# EAGLE design BLCTRL20 (EAGLE 6.1)
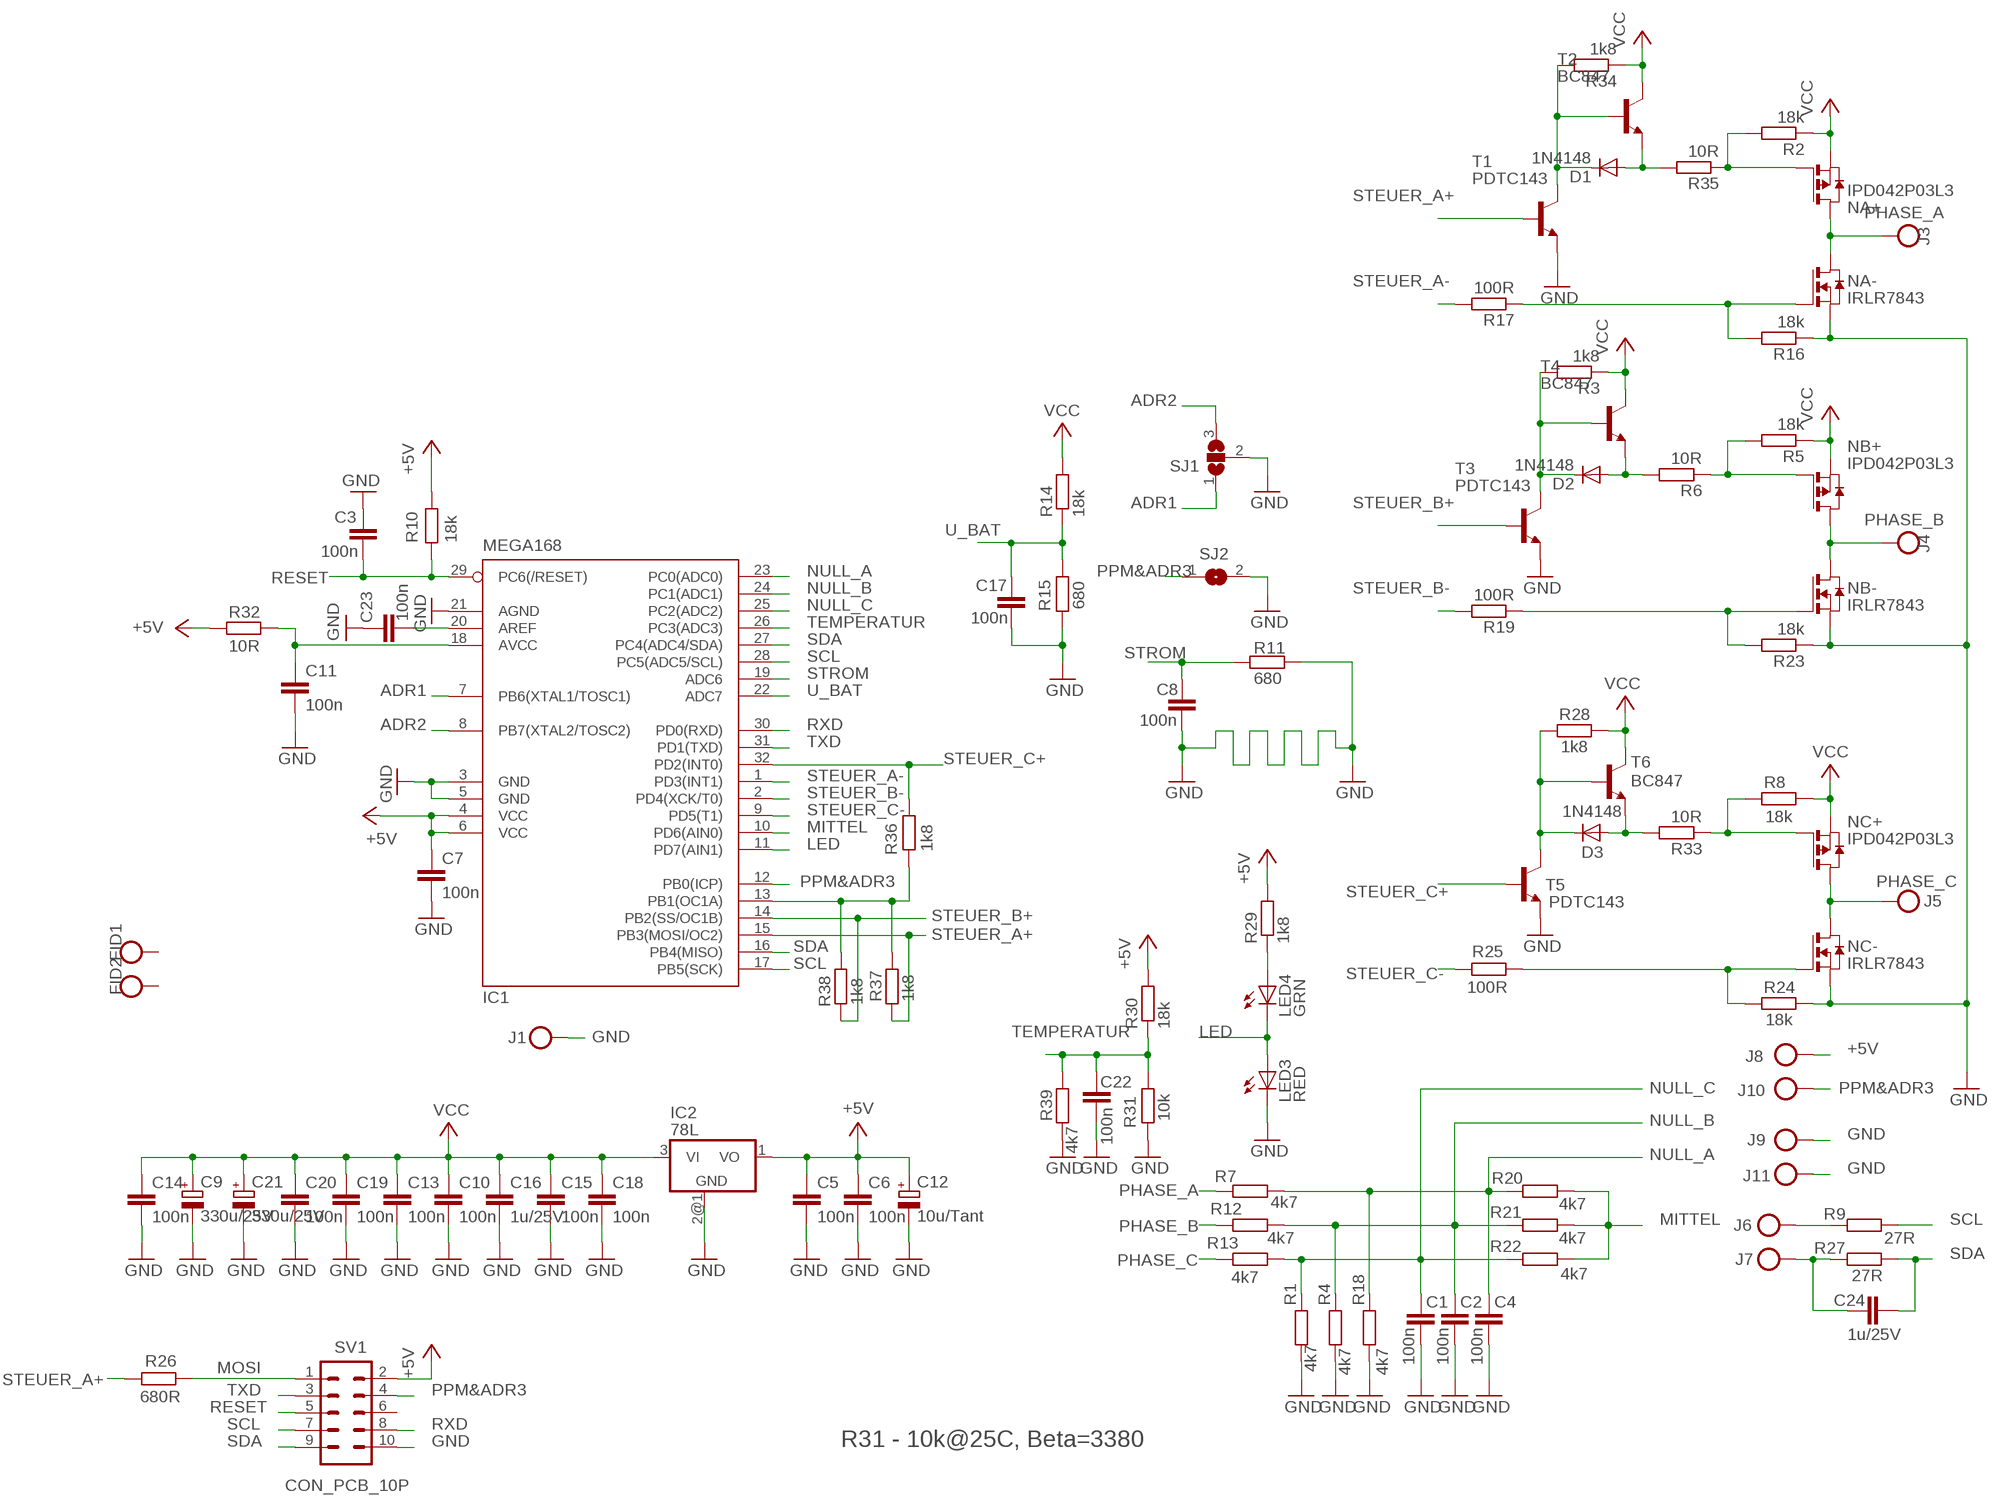
[diagram p0: schematic, sheet 1]

## Parts
C1  100n  C-EUC0603  [C0603]
C2  100n  C-EUC0603  [C0603]
C3  100n  C-EUC0603  [C0603]
C4  100n  C-EUC0603  [C0603]
C5  100n  C-EUC0603  [C0603]
C6  100n  C-EUC0603  [C0603]
C7  100n  C-EUC0603  [C0603]
C8  100n  C-EUC0603  [C0603]
C9  330u/25V  CPOL-EUE2.5-5  [E2,5-5]
C10  100n  C-EUC0603  [C0603]
C11  100n  C-EUC0603  [C0603]
C12  10u/Tant  CPOL-EUB  [PANASONIC_B]
C13  100n  C-EUC0603  [C0603]
C14  100n  C-EUC0603  [C0603]
C15  100n  C-EUC0603  [C0603]
C16  1u/25V  C-EUC0603  [C0603]
C17  100n  C-EUC0603  [C0603]
C18  100n  C-EUC0603  [C0603]
C19  100n  C-EUC0603  [C0603]
C20  100n  C-EUC0603  [C0603]
C21  330u/25V  CPOL-EUE2.5-5  [E2,5-5]
C22  100n  C-EUC0603  [C0603]
C23  100n  C-EUC0603  [C0603]
C24  1u/25V  C-EUC0603  [C0603]
D1  1N4148  DIODE-SOD323-W  [SOD323-W]
D2  1N4148  DIODE-SOD323-W  [SOD323-W]
D3  1N4148  DIODE-SOD323-W  [SOD323-W]
FID1  FIDUCIAL  [FIDUCIAL_MARK]
FID2  FIDUCIAL  [FIDUCIAL_MARK]
IC1  MEGA168  [TQFP32-08]
IC2  78L  [SOT89]
J1  SMDPAD40X20  [PAD40X20]
J3  SMDPAD40X20  [PAD40X20]
J4  SMDPAD40X20  [PAD40X20]
J5  SMDPAD40X20  [PAD40X20]
J6  SE11  [SE11]
J7  SE11  [SE11]
J8  SMDPAD25X25  [PAD24X15]
J9  SMDPAD25X25  [PAD24X15]
J10  SMDPAD25X25  [PAD24X15]
J11  SMDPAD24X12  [PAD24X12]
LED3  RED  LEDCHIPLED_0603  [CHIPLED_0603]
LED4  GRN  LEDCHIPLED_0603  [CHIPLED_0603]
NA+  IPD042P03L3  [TO252]
NA-  IRLR7843  [TO252]
NB+  IPD042P03L3  [TO252]
NB-  IRLR7843  [TO252]
NC+  IPD042P03L3  [TO252]
NC-  IRLR7843  [TO252]
R1  4k7  R-EU_R0603  [R0603]
R2  18k  R-EU_R0805  [R0805]
R3  1k8  R-EU_R0603  [R0603]
R4  4k7  R-EU_R0603  [R0603]
R5  18k  R-EU_R0805  [R0805]
R6  10R  R-EU_R0603  [R0603]
R7  4k7  R-EU_R0603  [R0603]
R8  18k  R-EU_R0805  [R0805]
R9  27R  R-EU_R0603  [R0603]
R10  18k  R-EU_R0603  [R0603]
R11  680  R-EU_R0603  [R0603]
R12  4k7  R-EU_R0603  [R0603]
R13  4k7  R-EU_R0603  [R0603]
R14  18k  R-EU_R0603  [R0603]
R15  680  R-EU_R0603  [R0603]
R16  18k  R-EU_R0805  [R0805]
R17  100R  R-EU_R0603  [R0603]
R18  4k7  R-EU_R0603  [R0603]
R19  100R  R-EU_R0603  [R0603]
R20  4k7  R-EU_R0603  [R0603]
R21  4k7  R-EU_R0603  [R0603]
R22  4k7  R-EU_R0603  [R0603]
R23  18k  R-EU_R0805  [R0805]
R24  18k  R-EU_R0805  [R0805]
R25  100R  R-EU_R0603  [R0603]
R26  680R  R-EU_R0603  [R0603]
R27  27R  R-EU_R0603  [R0603]
R28  1k8  R-EU_R0603  [R0603]
R29  1k8  R-EU_R0603  [R0603]
R30  18k  R-EU_R0603  [R0603]
R31  10k  R-EU_R0603  [R0603]
R32  10R  R-EU_R0603  [R0603]
R33  10R  R-EU_R0603  [R0603]
R34  1k8  R-EU_R0603  [R0603]
R35  10R  R-EU_R0603  [R0603]
R36  1k8  R-EU_R0603  [R0603]
R37  1k8  R-EU_R0603  [R0603]
R38  1k8  R-EU_R0603  [R0603]
R39  4k7  R-EU_R0603  [R0603]
SJ1  SJ2W  [SJ_2]
SJ2  SJ  [SJ]
SV1  CON_PCB_10P  [BOARD_CON_SMD]
T1  PDTC143  [SC75_INFINEON]
T2  BC847  [SC75_INFINEON]
T3  PDTC143  [SC75_INFINEON]
T4  BC847  [SC75_INFINEON]
T5  PDTC143  [SC75_INFINEON]
T6  BC847  [SC75_INFINEON]

## Nets
+5V: C5.1 C6.1 C7.1 C12.+ IC1.4(VCC) IC1.6(VCC) IC2.1(VO) J8.P$1(MP) R10.2 R29.2 R30.2 R32.2 SV1.2
ADR1: IC1.7(PB6(XTAL1/TOSC1)) SJ1.1
ADR2: IC1.8(PB7(XTAL2/TOSC2)) SJ1.3
GND: C1.2 C2.2 C3.1 C4.2 C5.2 C6.2 C7.2 C8.2 C9.- C10.2 C11.2 C12.- C13.2 C14.2 C15.2 C16.2 C17.2 C18.2 C19.2 C20.2 C21.- C22.2 C23.1 IC1.3(GND) IC1.5(GND) IC1.21(AGND) IC2.2@1(GND) J1.P$1(MP) J9.P$1(MP) J11.P$1(MP) LED3.C NA-.3(S) NB-.3(S) NC-.3(S) R1.1 R4.1 R11.1 R15.1 R16.1 R18.1 R23.1 R24.1 R31.1 R39.1 SJ1.2 SJ2.2 SV1.10 T1.2(E) T3.2(E) T5.2(E)
LED: IC1.11(PD7(AIN1)) LED3.A LED4.C
MITTEL: IC1.10(PD6(AIN0)) R20.1 R21.1 R22.1
MOSI: R26.1 SV1.1
N$1: LED4.A R29.1
N$4: NA-.1(G) R16.2 R17.1
N$6: NA+.1(G) R2.2 R35.1
N$8: D1.A R35.2 T2.2(E)
N$9: D1.C R34.2 T1.3(C) T2.1(B)
N$10: C24.2 J7.MP R27.2
N$11: J6.MP R9.2
N$17: NC-.1(G) R24.2 R25.1
N$18: NB-.1(G) R19.1 R23.2
N$20: NC+.1(G) R8.2 R33.1
N$22: NB+.1(G) R5.2 R6.1
N$23: D2.A R6.2 T4.2(E)
N$24: D3.A R33.2 T6.2(E)
N$27: D2.C R3.2 T3.3(C) T4.1(B)
N$28: D3.C R28.2 T5.3(C) T6.1(B)
N$51: IC1.13(PB1(OC1A)) R36.1 R37.2 R38.2
N$72: C23.2 IC1.20(AREF)
N$73: C11.1 IC1.18(AVCC) R32.1
NULL_A: C4.1 IC1.23(PC0(ADC0)) R7.1 R18.2 R20.2
NULL_B: C2.1 IC1.24(PC1(ADC1)) R4.2 R12.1 R21.2
NULL_C: C1.1 IC1.25(PC2(ADC2)) R1.2 R13.1 R22.2
PHASE_A: J3.P$1(MP) NA+.2(D) NA-.2(D) R7.2
PHASE_B: J4.P$1(MP) NB+.2(D) NB-.2(D) R12.2
PHASE_C: J5.P$1(MP) NC+.2(D) NC-.2(D) R13.2
PPM&ADR3: IC1.12(PB0(ICP)) J10.P$1(MP) SJ2.1 SV1.4
RESET: C3.2 IC1.29(PC6(/RESET)) R10.1 SV1.5
RXD: IC1.30(PD0(RXD)) SV1.8
SCL: IC1.17(PB5(SCK)) IC1.28(PC5(ADC5/SCL)) R9.1 SV1.7
SDA: C24.1 IC1.16(PB4(MISO)) IC1.27(PC4(ADC4/SDA)) R27.1 SV1.9
STEUER_A+: IC1.15(PB3(MOSI/OC2)) R26.2 R37.1 T1.1(B)
STEUER_A-: IC1.1(PD3(INT1)) R17.2
STEUER_B+: IC1.14(PB2(SS/OC1B)) R38.1 T3.1(B)
STEUER_B-: IC1.2(PD4(XCK/T0)) R19.2
STEUER_C+: IC1.32(PD2(INT0)) R36.2 T5.1(B)
STEUER_C-: IC1.9(PD5(T1)) R25.2
STROM: C8.1 IC1.19(ADC6) R11.2
TEMPERATUR: C22.1 IC1.26(PC3(ADC3)) R30.1 R31.2 R39.2
TXD: IC1.31(PD1(TXD)) SV1.3
U_BAT: C17.1 IC1.22(ADC7) R14.1 R15.2
VCC: C9.+ C10.1 C13.1 C14.1 C15.1 C16.1 C18.1 C19.1 C20.1 C21.+ IC2.3(VI) NA+.3(S) NB+.3(S) NC+.3(S) R2.1 R3.1 R5.1 R8.1 R14.2 R28.1 R34.1 T2.3(C) T4.3(C) T6.3(C)
Unconnected: FID1.P$1(MP) FID2.P$1(MP) SV1.6

## Notes on the sheet
- R31 - 10k@25C, Beta=3380

## Library data of the parts
C1-C8 C10 C11 C13-C20 C22-C24 = blctrl20:C-EU: CAPACITOR, European symbol
C9 C12 C21 = blctrl20:CPOL-EU: POLARIZED CAPACITOR, European symbol
D1-D3 = blctrl20:DIODE-: DIODE
FID1 FID2 = blctrl20:FIDUCIAL
IC1 = blctrl20:MEGA168
IC2 = blctrl20:78L*: POSITOIV-VOLTAGE REGULATORS Output up to 100 mA Source: http://focus.ti.com/lit/ds/symlink/ua78l05.pdf
J1 J3-J5 J8-J11 = blctrl20:SMDPAD
J6 J7 = blctrl20:SE11: SOLDER PAD RTM, drill 1,1mm, distributor Buerklin, 07F810
LED3 LED4 = led:LED: LED OSRAM: - CHIPLED LG R971, LG N971, LY N971, LG Q971, LY Q971, LO R971, LY R971 LH N974, LH R974 LS Q976, LO Q976, LY Q976 LO Q996 - Hyper CHIPLED LW Q18S LB Q993, LB Q99A, LB R99A - SideLED LS A670, LO A670, LY A670, LG A670, LP A670 LB A673, LV A673, LT A673, LW A673 LH A674 LY A675 LS A676, LA A676, LO A676, LY A676, LW A676 LS A679, LY A679, LG A679 - Hyper Micro SIDELED® LS Y876, LA Y876, LO Y876, LY Y876 LT Y87S - SmartLED LW L88C, LW L88S LB L89C, LB L89S, LG L890 LS L89K, LO L89K, LY L89K LS L896, LA L896, LO L896, LY L896 - TOPLED LS T670, LO T670, LY T670, LG T670, LP T670 LSG T670, LSP T670, LSY T670, LOP T670, LYG T670 LG T671, LOG T671, LSG T671 LB T673, LV T673, LT T673, LW T673 LH T674 LS T676, LA T676, LO T676, LY T676, LB T676, LH T676, LSB T676, LW T676 LB T67C, LV T67C, LT T67C, LS T67K, LO T67K, LY T67K, LW E67C LS E67B, LA E67B, LO E67B, LY E67B, LB E67C, LV E67C, LT E67C LW T67C LS T679, LY T679, LG T679 LS T770, LO T770, LY T770, LG T770, LP T770 LB T773, LV T773, LT T773, LW T773 LH T774 LS E675, LA E675, LY E675, LS T675 LS T776, LA T776, LO T776, LY T776, LB T776 LHGB T686 LT T68C, LB T68C - Hyper Mini TOPLED® LB M676 - Mini TOPLED Santana® LG M470 LS M47K, LO M47K, LY M47K Source: http://www.osram.convergy.de LUXEON: - LUMILED® LXK2-PW12-R00, LXK2-PW12-S00, LXK2-PW14-U00, LXK2-PW14-V00 LXK2-PM12-R00, LXK2-PM12-S00, LXK2-PM14-U00 LXK2-PE12-Q00, LXK2-PE12-R00, LXK2-PE12-S00, LXK2-PE14-T00, LXK2-PE14-U00 LXK2-PB12-K00, LXK2-PB12-L00, LXK2-PB12-M00, LXK2-PB14-N00, LXK2-PB14-P00, LXK2-PB14-Q00 LXK2-PR12-L00, LXK2-PR12-M00, LXK2-PR14-Q00, LXK2-PR14-R00 LXK2-PD12-Q00, LXK2-PD12-R00, LXK2-PD12-S00 LXK2-PH12-R00, LXK2-PH12-S00 LXK2-PL12-P00, LXK2-PL12-Q00, LXK2-PL12-R00 Source: www.luxeon.com KINGBRIGHT: KA-3528ASYC Source: www.kingbright.com
NA+ NB+ NC+ = blctrl20:IPD042P03L3
NA- NB- NC- = blctrl20:IRLR7843
R1-R39 = blctrl20:R-EU_: RESISTOR, European symbol
SJ1 = jumper:SJ2W: SMD solder JUMPER
SJ2 = jumper:SJ: SMD solder JUMPER
SV1 = blctrl20:CON_PCB_10P
T1 T3 T5 = blctrl20:PDTC143
T2 T4 T6 = blctrl20:BC847: NPN TRANSISTOR

## Board
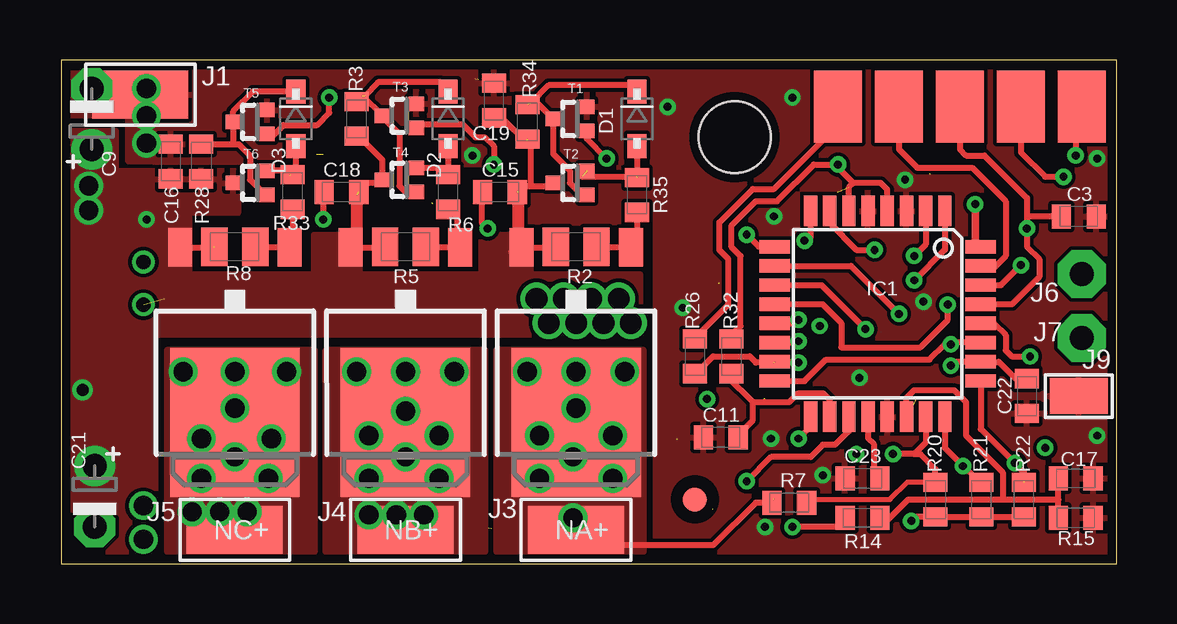
[diagram p1: board, top side]
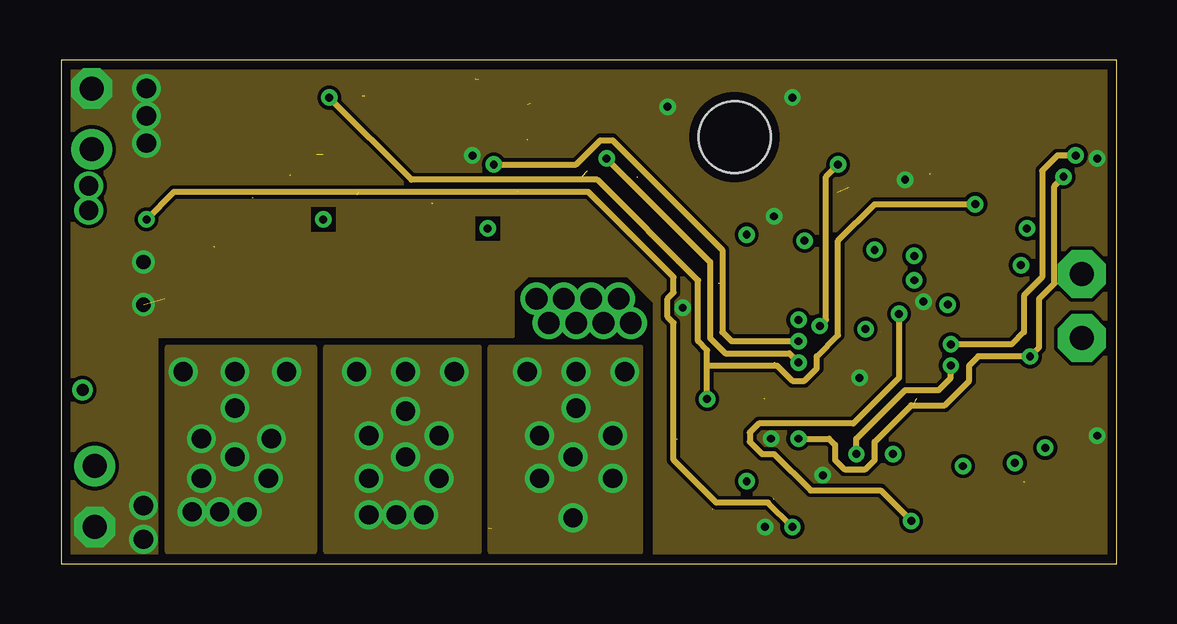
[diagram p2: board, inner layer Route2]
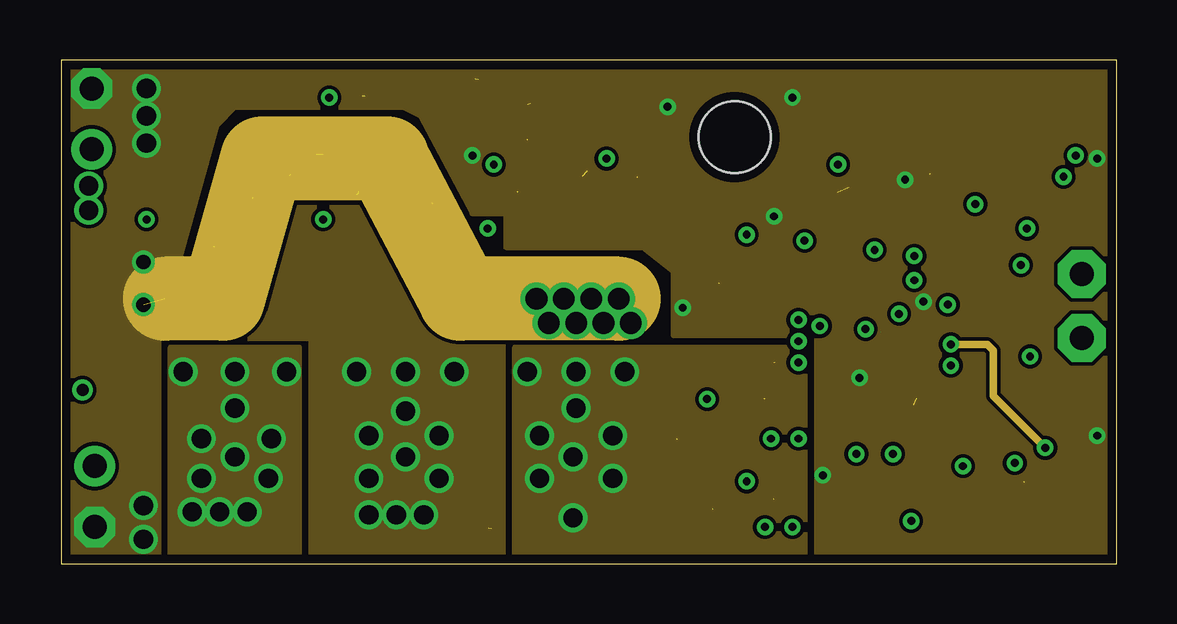
[diagram p3: board, inner layer Route15]
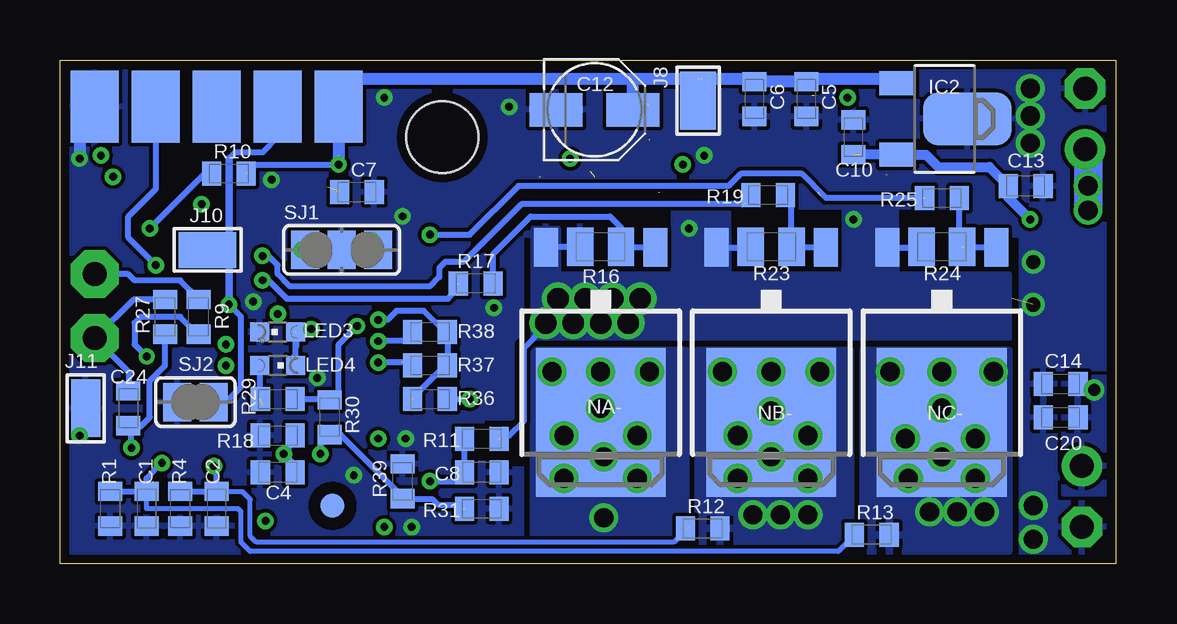
[diagram p4: board, bottom side, seen from below]

Size 44 x 21 mm. Coordinates in mm from the lower left corner, seen from the top.
Outline: 0,0 44,0 44,21 0,21 0,0
Copper layers (1*2*15*16): Top 0.035mm / dielectric 0.5mm / Route2 0.015mm / dielectric 0.5mm / Route15 0.015mm / dielectric 0.5mm / Bottom 0.035mm
Design rules: minimum track width 6mil, minimum drill 13mil, track to track 6mil, track to pad 6mil, pad to pad 6mil, via to via 6mil, smd to smd 6mil, copper to edge 15mil, drill to drill 6mil, minimum pad ring 7mil, minimum via ring 7mil, stop-mask expansion 4mil, vias tented up to drill 1mm, thermal gap 6mil
Holes 3 mm at 28.07,17.78
tRestrict: area 16,14 to 18.8,16.5; area 10.2,14 to 11.9,16.5
bRestrict: area 14.5,13.7 to 16,16; area 6.9,13.7 to 8.4,14.7; area 25.9,4.3 to 26.7,5.8; area 24.6,4.1 to 25.7,4.8; area 8.1,13.7 to 9,14.7; area 11.4,14.1 to 13.5,14.7; area 18.5,14.1 to 20.8,14.7

### Footprints (pad centres in the part's own frame; a part is rotated, then mirrored left to right if it is on the bottom)
C0603 = smd 0.8 x 1: 1 -0.723,0; 2 0.723,0
E2,5-5 = drill 1 pad 1.7: + -1.27,0 | drill 1 pad 1.7 octagon: - 1.27,0
PANASONIC_B = smd 2.2 x 1.4: + 1.6,0; - -1.6,0
SOD323-W = smd 1 x 0.8: A 1.143,0; C -1.143,0
FIDUCIAL_MARK = smd 1 x 1: P$1 0,0
TQFP32-08 = smd 1.27 x 0.559: 1 -4.293,2.8; 2 -4.293,2; 3 -4.293,1.2; 4 -4.293,0.4; 5 -4.293,-0.4; 6 -4.293,-1.2; 7 -4.293,-2; 8 -4.293,-2.8; 17 4.293,-2.8; 18 4.293,-2; 19 4.293,-1.2; 20 4.293,-0.4; 21 4.293,0.4; 22 4.293,1.2; 23 4.293,2; 24 4.293,2.8 | smd 0.559 x 1.27: 9 -2.8,-4.293; 10 -2,-4.293; 11 -1.2,-4.293; 12 -0.4,-4.293; 13 0.4,-4.293; 14 1.2,-4.293; 15 2,-4.293; 16 2.8,-4.293; 25 2.8,4.293; 26 2,4.293; 27 1.2,4.293; 28 0.4,4.293; 29 -0.4,4.293; 30 -1.2,4.293; 31 -2,4.293; 32 -2.8,4.293
SOT89 = smd 1 x 1.5: 1 -1.499,-1.981; 3 1.499,-1.981 | smd 2.2 x 3.7: 2@1 0,0.94
PAD40X20 = smd 4 x 2: P$1 0,0
SE11 = drill 1 pad 2 octagon: MP 0,0
PAD24X15 = smd 2.4 x 1.5: P$1 0,0
PAD24X12 = smd 2.4 x 1.2: P$1 0,0
CHIPLED_0603 = smd 0.8 x 0.8: A 0,-0.75; C 0,0.75
TO252 = smd 1 x 1.6: 1 -2.28,-4.8; 3 2.28,-4.8 | smd 5.4 x 6.2: 2 0,2.5
R0603 = smd 0.8 x 1: 1 -0.723,0; 2 0.723,0
R0805 = smd 1.1 x 1.6: 1 -0.85,0; 2 0.85,0
SJ_2 = smd 1.168 x 1.6: 1 -1.524,0; 2 0,0; 3 1.524,0
SJ = smd 1.168 x 1.6: 1 -0.762,0; 2 0.762,0
BOARD_CON_SMD = smd 2 x 3: 1 0,0; 3 2.54,0; 5 5.08,0; 7 7.62,0; 9 10.16,0 | smd 2 x 3 bottom: 2 0,0; 4 2.54,0; 6 5.08,0; 8 7.62,0; 10 10.16,0
SC75_INFINEON = smd 0.6 x 0.65: 1 -0.5,-0.702; 2 0.5,-0.702; 3 0,0.702

### Placement (x,y rotation side)
C1  40.39,2.29 270 bottom
C2  37.47,2.29 270 bottom
C3  42.42,14.48 180 top
C4  34.92,3.81 180 bottom
C5  12.89,19.37 270 bottom
C6  15.05,19.37 270 bottom
C7  31.62,15.49 0 bottom
C8  26.42,3.81 0 bottom
C9  1.27,18.54 90 top
C10  10.92,17.78 90 bottom
C11  27.5,5.27 180 top
C12  21.72,18.92 0 bottom
C13  3.75,15.75 0 bottom
C14  2.29,7.49 180 bottom
C15  18.29,15.49 180 top
C16  4.57,16.76 90 top
C17  42.29,1.91 0 top
C18  11.68,15.49 180 top
C19  18.03,19.3 90 top
C20  2.29,6.1 180 bottom
C21  1.4,2.79 270 top
C22  40.26,6.99 270 top
C23  33.4,3.56 0 top
C24  41.15,6.48 90 bottom
D1  24,18.54 270 top
D2  16.13,18.54 270 top
D3  9.78,18.54 270 top
FID1  26.42,2.67 0 top
FID2  32.64,2.41 0 bottom
IC1  34.04,10.41 270 top
IC2  7.11,18.54 270 bottom
J1  3.3,19.56 0 top
J3  21.46,1.4 0 top
J4  14.35,1.4 0 top
J5  7.24,1.4 0 top
J6  42.55,12.06 0 top
J7  42.55,9.4 0 top
J8  17.4,19.3 270 bottom
J9  42.42,6.99 0 top
J10  37.85,13.08 0 bottom
J11  42.93,6.48 270 bottom
LED3  34.92,9.65 90 bottom
LED4  34.92,8.26 270 bottom
NA+  21.46,8.38 180 top
NA-  21.46,8.38 180 bottom
NB+  14.35,8.38 180 top
NB-  14.35,8.38 180 bottom
NC+  7.24,8.38 180 top
NC-  7.24,8.38 180 bottom
R1  41.91,2.29 90 bottom
R2  21.46,13.21 0 top
R3  12.32,18.54 90 top
R4  38.99,2.29 90 bottom
R5  14.35,13.21 0 top
R6  16.13,15.49 90 top
R7  30.35,2.54 180 top
R8  7.24,13.21 0 top
R9  38.23,10.29 90 bottom
R10  36.96,16.26 0 bottom
R11  26.42,5.21 180 bottom
R12  17.21,1.46 0 bottom
R13  10.16,1.21 0 bottom
R14  33.4,1.91 180 top
R15  42.29,3.56 180 top
R16  21.46,13.21 0 bottom
R17  26.67,11.68 180 bottom
R18  34.92,5.33 0 bottom
R19  14.48,15.37 180 bottom
R20  36.45,2.67 90 top
R21  38.35,2.67 90 top
R22  40.13,2.67 90 top
R23  14.35,13.21 0 bottom
R24  7.24,13.21 0 bottom
R25  7.24,15.24 180 bottom
R26  26.42,8.64 270 top
R27  39.62,10.29 90 bottom
R28  5.84,16.76 90 top
R29  34.92,6.86 0 bottom
R30  32.77,6.1 90 bottom
R31  26.42,2.29 180 bottom
R32  27.94,8.64 90 top
R33  9.65,15.49 90 top
R34  19.43,18.41 90 top
R35  24,15.37 90 top
R36  28.57,6.86 0 bottom
R37  28.57,8.26 0 bottom
R38  28.57,9.65 0 bottom
R39  29.72,3.43 270 bottom
SJ1  32.26,13.08 0 bottom
SJ2  38.35,6.73 180 bottom
SV1  32.38,19.05 0 top
T1  21.21,18.54 90 top
T2  21.21,15.88 90 top
T3  14.1,18.67 90 top
T4  14.1,16 90 top
T5  7.87,18.41 90 top
T6  7.87,15.88 90 top

### Tracks (layer width: path | path; a pad name or v marks a point on that pad's centre or on a via)
+5V  (via drill 0.33 pad 0.41, 0.33 pad 0.69)  (3 unrouted)
  Top 0.254: R32.2 27.69,9.27 28.32,9.91 28.32,12.83 27.94,13.21 27.94,14.1 28.96,15.11 29.84,15.11 31.37,16.64 v32.38,16.64 32.38,16.51 33.02,15.88 | IC1.4 34.44,15.6 34.16,15.88 33.02,15.88 | IC1.6 32.84,15.69 33.02,15.88
  Route2 0.254: v31.62,9.91 31.88,10.16 31.88,16.13 v32.38,16.64
  Bottom 0.254: v31.62,9.91 32.38,9.14 32.38,7.11 32.51,7.11 R30.2 32.8,6.86 R29.2 | 32.35,16.55 v32.38,16.64 35.94,16.64 35.94,16.51 36.2,16.26 | 32.26,19.18 SV1.2
  Bottom 0.406: IC2.1 9.37,20.04 9.65,20.19 | 12.66,20.19 C5.1 | J8.P$1 17.4,20.19 | 32.26,20.19 32.26,19.18 | 20.12,20.12 20.19,20.19 | 15.18,20.22 C6.1
  Bottom 0.508: SV1.2 v32.38,16.64 | 9.65,20.19 12.66,20.19 | C5.1 C6.1 | 17.4,20.19 20.19,20.19 32.26,20.19 | C12.+ 20.12,20.12 | 17.25,20.22 15.18,20.22
ADR1  (via drill 0.33 pad 0.41)
  Top 0.254: v33.91,13.08 33.15,13.08 32.04,14.19 IC1.7
  Bottom 0.305: SJ1.1 33.66,12.83 v33.91,13.08
ADR2  (via drill 0.33 pad 0.41)
  Top 0.254: IC1.8 31.24,13.6 v30.99,13.46
  Bottom 0.305: v30.99,13.46 30.99,13.08 SJ1.3
GND  (via drill 0.33 pad 0.25, 0.33 pad 0.41, 0.6 pad 0.41, 0.8, 0.9)  (2 unrouted)
  Top 0.254: v3.56,17.53 4.57,17.53 | C18.2 10.92,15.49 v10.92,14.35 | C15.2 17.53,15.49 17.53,14.22 v17.78,13.97
  Route15 3.5: v23.24,11.05 16.64,11.05 13.59,16.89 8.38,16.89 6.73,11.05 4.32,11.05
  Bottom 0.254: SV1.10 42.55,18.92 43.18,18.03 | NC-.3 8.12,13.18 R24.1 | NB-.3 15.1,13.18 R23.1 | 23.88,9.78 24.68,8.98 24.68,5.93 25.27,5.33 25.53,5.33 25.65,5.21 | 20.45,10.16 20.57,10.29 | R16.1 23.72,13.21 NA-.3
  Bottom 0.508: 43.18,18.03 v43.18,16.89
  other vias: 19.81,11.05 20.32,10.03 20.95,11.05 21.46,10.03 22.1,11.05 22.61,10.03 23.75,10.03 3.56,19.81 3.56,18.67 3.43,2.41 3.43,1.02 33.27,7.75 29.72,14.48 3.43,12.57 3.43,10.79 35.94,10.92 29.59,5.21 29.34,1.52 31.75,3.68 35.18,16 30.48,19.43 25.27,19.05 17.14,17.02 25.91,10.67 43.18,5.33
  pour Top: 3.81,20.95 3.81,16.76 7.87,16.76 7.87,14.22 24.77,14.22 24.77,0 43.94,0 44.07,20.95
  pour Bottom (rank 2): 0,20.83 43.94,20.83 43.94,0 24.77,0 24.77,4.19 26.42,4.19 26.42,6.1 25.15,6.1 25.15,9.27 24.77,9.65 24.77,13.72 3.94,13.72 3.94,0 0,0 0,3.68 2.54,3.68 2.54,8.13 0,8.13
  pour Bottom (no thermals): 4.45,12.06 4.45,9.4 24.26,9.4 24.26,13.97 23.24,13.97 23.24,12.06 18.41,12.06 18.41,14.1 16.13,14.1 16.13,12.06 11.3,12.06 11.3,14.1 9.14,14.1 9.14,12.06
  pour Route15 (no thermals): 0,0 4.06,0 4.06,12.83 4.95,12.83 6.48,18.29 7.24,19.05 14.22,19.05 14.99,18.67 17.14,14.61 18.54,14.61 18.54,13.21 24.26,13.21 25.53,12.19 25.53,9.53 31.5,9.53 31.5,0 43.94,0 43.94,21.08 0,21.08
  pour Route2 (no thermals): 0,0 3.94,0 3.94,9.53 18.8,9.53 18.8,11.43 19.43,12.06 23.62,12.06 24.77,10.92 24.77,0 43.94,0 43.94,21.08 0,21.08
  pour Top (no thermals): 0,20.45 3.81,20.45 3.81,16.76 2.79,16.76 2.79,18.67 0,18.67
LED  (via drill 0.33 pad 0.41)  (1 unrouted)
  Top 0.254: IC1.11 31.69,11.61 v33.53,9.78
  Bottom 0.254: LED4.C LED3.A 34.16,9.02 | v33.53,9.78 34.04,9.78 LED3.A
MITTEL  (via drill 0.33 pad 0.41)
  Top 0.254: R22.1 R21.1 R20.1 35.6,1.94 v35.43,1.78 | IC1.10 32.92,12.41 v34.92,10.41
  Route2 0.254: v34.92,10.41 34.92,7.75 33.02,5.84 29.08,5.84 28.7,5.46 28.7,5.08 29.21,4.57 29.72,4.57 31.24,3.05 34.16,3.05 v35.43,1.78
MOSI
  Top 0.254: R26.1 26.42,9.4 27.81,10.79 27.81,12.7 27.43,13.08 27.43,14.22 28.83,15.62 29.72,15.62 31.75,17.65 31.75,19.43 SV1.1
N$1  (2 unrouted)
  Bottom 0.254: 35.55,6.62 35.56,6.6 | LED4.A 35.67,6.87 35.69,6.86
N$2
  cutout Route2: 10.41,14.86 11.43,14.86 11.43,13.84 10.41,13.84
N$3
  cutout Route2: 17.27,14.48 18.29,14.48 18.29,13.46 17.27,13.46
N$4
  Bottom 0.254: R17.1 25.95,12.91 24.38,14.48 21.08,14.48 20.61,14.01 R16.2 19.21,13.21 NA-.1
N$6
  Top 0.254: R35.1 24,13.31 NA+.1 23.72,13.21 R2.2
N$8  (2 unrouted)
  Top 0.254: 21.72,16.13 24,16.13 | D1.A R35.2
N$9  (1 unrouted)
  Top 0.254: R34.2 19.78,19.27 T1.3 20.51,17.09 21.21,16.38 21.21,15.88 21.71,15.38 T2.1 | 19.56,19.18 20.32,19.94 23.72,19.94 23.97,19.68 D1.C
N$10
  Bottom 0.254: R27.2 40.93,11.01 J7.MP 41.11,7.96 41.11,7.2 C24.2
N$11
  Bottom 0.254: 38.1,11.05 R9.2 38.23,11.05 38.99,11.81 40.89,11.81 41.15,12.06 J6.MP
N$17
  Bottom 0.254: R25.1 6.52,13.34 R24.2 6.36,13.18 NC-.1
N$18
  Bottom 0.254: R19.1 13.5,15.37 R23.2 13.47,13.18 NB-.1
N$20
  Top 0.254: R33.1 9.65,13.44 NC+.1 9.49,13.21 R8.2
N$22
  Top 0.254: R5.2 16.61,13.21 NB+.1 16.51,13.3 16.51,14.48 16.22,14.77 R6.1
N$23
  Top 0.254: T4.2 15.72,16.5 R6.2 D2.A
N$24  (1 unrouted)
  Top 0.254: 9.78,16.34 R33.2 9.56,16.22 9.4,16.38 8.7,16.38 T6.2 | D3.A 9.78,16.45 arc-90 9.53,16.19
N$27  (1 unrouted)
  Top 0.254: R3.2 12.66,19.52 13.21,20.07 15.81,20.07 15.88,20 D2.C | 12.54,19.52 T3.3 13.39,18.61 14.1,17.91 14.1,15.75 14.34,15.5 T4.1
N$28
  Top 0.254: R28.2 7.11,17.49 | 7.11,17.49 7.41,17.49 7.87,17.02 7.87,16 8.37,15.5 T6.1 | 7.11,17.49 7.17,17.55 T5.3 7.17,18.86 8,19.68 D3.C
N$51  (via drill 0.33 pad 0.36)  (1 unrouted)
  Top 0.254: IC1.13 30.71,10.01 v30.73,10.16
  Bottom 0.254: v30.73,10.16 30.35,10.16 29.97,10.54 28.83,10.54 27.98,9.69 R38.2 R37.2 27.94,8.26 29.34,6.86 | R36.1 29.34,6.48
N$72
  Top 0.254: IC1.20 33.64,5.23 33.87,4.99 33.87,3.68 C23.2
N$73
  Top 0.254: 28.83,6.73 30.35,6.73 30.73,7.11 31.75,7.11 32.04,6.83 IC1.18 | R32.1 27.77,7.79 28.83,6.73 | C11.1 28.35,5.49 28.83,5.97 28.83,6.73
NULL_A  (via drill 0.33 pad 0.41)
  Top 0.203: 31.24,2.67 34.54,2.67 35.27,3.39 R20.2
  Top 0.254: R7.1 30.99,2.54 31.24,2.67 | 35.56,4.57 35.81,4.57 36.45,3.94 R20.2 | 35.56,4.57 v34.67,4.57 | 35.56,4.57 36.04,5.05 IC1.23
  Bottom 0.254: R18.2 34.2,5.17 v34.67,4.57 34.2,4.1 C4.1
NULL_B  (via drill 0.33 pad 0.41)  (1 unrouted)
  Top 0.254: R21.2 v37.59,4.06 36.83,4.83 IC1.24
  Top 0.406: IC1.24
  Bottom 0.203: 17.8,1.5 18.41,0.89 35.81,0.89 36.07,1.14 36.07,2.67 36.41,3.01 C2.1
  Bottom 0.254: R4.2 C2.1 37.47,3.94 v37.59,4.06
NULL_C  (via drill 0.33 pad 0.41)  (1 unrouted)
  Top 0.254: IC1.25 38.33,5.61 v39.75,4.19 40.13,3.81 40.13,3.43
  Bottom 0.203: C1.1 40.39,2.29 36.58,2.29 36.45,2.16 36.45,0.89 36.07,0.51 11.56,0.51 10.88,1.18 R13.1
  Bottom 0.254: C1.1 40.39,3.05 | R1.2 C1.1 | v39.75,4.19 40.39,3.56 C1.1
PHASE_A  (via drill 0.8 pad 0.25, 0.8 pad 0.8)
  Top 0.254: R7.2 28.96,2.54 27.18,0.76 21.59,0.76
  Top 0.305: 21.59,0.76 21.08,1.27
  other vias: 19.43,8 21.46,8 23.5,8 19.94,5.33 21.46,6.48 22.99,5.33 21.34,4.45 22.99,3.56 19.94,3.56 21.34,1.91
  pour Route15: 18.92,9.02 30.99,9.02 30.99,0.25 18.92,0.25
  pour Top (no thermals): 18.16,8.89 24.26,8.89 24.26,0.51 18.16,0.51
  pour Bottom (no thermals): 17.91,8.89 24.26,8.89 24.26,2.16 17.91,2.16
  pour Route2: 17.91,9.02 24.13,9.02 24.13,0.51 17.91,0.51
  pour Bottom: 17.91,2.16 24.26,2.16 24.26,0.64 17.91,0.64
PHASE_B  (via drill 0.8 pad 0.25, 0.8 pad 0.8)
  other vias: 12.83,5.33 14.35,6.35 12.32,8 14.35,8 16.38,8 15.75,5.33 14.35,4.45 12.83,3.56 15.75,3.56 12.83,2.03 13.97,2.03 15.11,2.03
  pour Route15: 10.41,0.13 18.41,0.25 18.41,10.67 13.21,15.75 8.89,15.75 7.49,9.4 10.41,9.4
  pour Top (no thermals): 11.05,8.89 17.65,8.89 17.65,0.51 11.05,0.51
  pour Bottom (no thermals): 11.05,8.89 17.4,8.89 17.4,2.16 11.05,2.16
  pour Bottom: 11.05,2.16 17.4,2.16 17.4,0.51 11.05,0.51
  pour Route2: 11.05,9.02 17.4,9.02 17.4,0.51 11.05,0.51
PHASE_C  (via drill 0.8 pad 0.25, 0.8 pad 0.8)
  other vias: 5.08,8 7.24,8 9.4,8 5.84,5.21 7.24,6.48 8.76,5.21 5.84,3.56 8.64,3.56 7.24,4.45 5.46,2.16 6.6,2.16 7.75,2.16
  pour Route15: 4.57,9.02 9.91,9.02 9.91,0.25 4.57,0.25
  pour Top (no thermals): 4.45,8.89 10.54,8.89 10.54,0.51 4.45,0.51
  pour Bottom (no thermals): 4.45,8.89 10.54,8.89 10.54,2.16 4.45,2.16
  pour Bottom: 4.45,2.16 10.54,2.16 10.54,0.51 4.45,0.51
  pour Route2: 4.45,9.02 10.54,9.02 10.54,0.51 4.45,0.51
PPM&ADR3  (via drill 0.33 pad 0.41)
  Top 0.254: v36.96,10.79 36.96,10.16 35.81,9.02 32.51,9.02 32.51,10.03 31.73,10.81 IC1.12
  Bottom 0.254: SV1.4 34.92,17.78 35.56,17.14 36.7,17.14 36.96,16.89 | SJ2.1 36.96,6.86 36.45,7.37 36.45,10.29 v36.96,10.79
  Bottom 0.305: v36.96,10.79 36.96,12.57 | 36.96,12.57 J10.P$1 | 36.96,16.89 36.96,12.57
RESET  (via drill 0.33 pad 0.41)
  Top 0.254: SV1.5 37.47,17.27 37.72,17.02 38.48,17.02 40.26,15.24 v40.26,13.97 | v40.26,13.97 40.26,13.21 40.77,12.7 40.77,11.94 39.64,10.81 IC1.29 | C3.2 40.26,14.48 v40.26,13.97
  Bottom 0.254: R10.1 37.93,16.3 v40.26,13.97
RXD  (via drill 0.33 pad 0.41)
  Top 0.254: IC1.30 39.17,11.61 v40.01,12.45
  Bottom 0.254: SV1.8 40.01,15.62 41.15,14.48 41.15,13.59 v40.01,12.45
SCL  (via drill 0.33 pad 0.41)
  Top 0.254: IC1.28 38.88,10.01 39.37,9.53 39.37,8.89 39.62,8.64 v40.39,8.64 | SV1.7 40.01,17.14 41.02,16.13 v41.78,16.13 | v30.73,5.21 31.24,5.71 IC1.17
  Route2 0.254: v41.78,16.13 41.4,15.75 41.4,11.68 40.77,11.05 40.77,9.02 v40.39,8.64 38.23,8.64 37.85,8.26 37.85,7.62 36.83,6.6 35.43,6.6 33.91,5.08 33.91,4.32 33.53,3.94 32.64,3.94 32.26,4.32 32.26,4.95 32,5.21 v30.73,5.21
  Bottom 0.254: R9.1 38.27,9.56 38.99,10.29 40.64,10.29 40.89,10.03 40.89,9.14 v40.39,8.64
SDA  (via drill 0.33 pad 0.41)
  Top 0.254: IC1.16 30.98,7.61 31.88,8.51 36.2,8.51 36.83,9.14 v37.08,9.14 36.9,9.21 IC1.27 | SV1.9 42.29,18.92 v42.29,17.02
  Route2 0.254: v42.29,17.02 41.53,17.02 40.89,16.38 40.89,11.94 40.13,11.18 40.13,9.65 39.62,9.14 v37.08,9.14
  Route15 0.305: v41.02,4.83 38.86,6.99 38.86,8.89 38.61,9.14 v37.08,9.14
  Bottom 0.254: v41.02,4.83 41.02,5.63 C24.1 40.64,5.71 40.26,6.1 40.26,7.62 39.62,8.26 R27.1
STEUER_A+  (via drill 0.33 pad 0.41)  (1 unrouted)
  Top 0.254: IC1.15 30.57,8.41 v30.73,8.38 | R26.2 26.67,8.13 27.18,8.64 28.7,8.64 28.96,8.38 29.72,8.38 | T1.1 21.91,17.71 v22.73,16.89
  Route2 0.254: v22.73,16.89 27.05,12.57 27.05,9.4 27.69,8.76 30.35,8.76 v30.73,8.38
  Bottom 0.254: R37.1 29.34,8.38 v30.73,8.38
STEUER_A-  (via drill 0.33 pad 0.41)  (1 unrouted)
  Top 0.254: IC1.1 36.84,13.09 v35.56,11.81
  Bottom 0.254: v35.56,11.81 35.31,11.81 34.54,11.05 27.81,11.05 27.43,11.43 27.43,11.68
STEUER_B+  (via drill 0.33 pad 0.41)
  Top 0.254: IC1.14 30.54,9.21 v30.73,9.27 | 14.87,18.17 T3.1 14.93,18.3 16.76,18.3 17.27,17.78 17.65,17.78 18.03,17.4 v18.03,16.64
  Route2 0.254: v18.03,16.64 21.46,16.64 22.48,17.65 22.99,17.65 27.56,13.08 27.56,9.65 27.94,9.27 v30.73,9.27
  Bottom 0.254: R38.1 29.34,9.27 v30.73,9.27
STEUER_B-  (via drill 0.33 pad 0.41)  (1 unrouted)
  Top 0.254: IC1.2 36.04,13.3 v35.56,12.83
  Bottom 0.254: R19.2 15.46,15.03 | 15.49,14.99 24.77,14.99 27.18,12.57 27.94,12.57 28.19,12.32 28.19,11.94 28.57,11.56 34.42,11.56 34.92,12.06 34.92,12.45 35.31,12.83 v35.56,12.83
STEUER_C+  (via drill 0.33 pad 0.3, 0.33 pad 0.41)
  Top 0.254: T5.1 8.77,17.79 9.27,18.29 10.67,18.29 11.18,18.8 v11.18,19.43
  Top 0.305: v38.1,14.99 38.1,13.24 IC1.32
  Route2 0.254: v38.1,14.99 33.91,14.99 32.38,13.46 32.38,9.53 31.5,8.64 31.5,8.13 30.99,7.62 30.48,7.62 29.84,8.26 26.92,8.26 | v26.92,6.86 26.92,8.26 | 26.92,8.26 26.92,8.89 26.54,9.27 26.54,11.81 22.35,16 14.61,16 v11.18,19.43
  Bottom 0.254: R36.2 v26.92,6.86
STEUER_C-  (via drill 0.33 pad 0.41)  (1 unrouted)
  Top 0.254: IC1.9 29.08,13.21 v28.57,13.72
  Bottom 0.254: 8,15.24 12.06,15.24 13.08,16.26 15.62,16.26 16.13,15.75 24.89,15.75 26.92,13.72 v28.57,13.72
STROM  (via drill 0.33 pad 0.41)
  Top 0.254: v28.57,3.43 29.59,4.45 31.24,4.45 31.75,4.95 32.26,4.95 32.84,5.53 IC1.19
  Bottom 0.254: v28.57,3.43 27.14,3.43 C8.1 R11.2
TEMPERATUR  (via drill 0.33 pad 0.41)  (2 unrouted)
  Top 0.254: C22.1 39.79,7.71 39.08,8.41 IC1.26 37.12,8.41 v37.08,8.26
  Route2 0.254: v33.15,4.57 33.15,5.21 35.18,7.24 36.58,7.24 37.08,7.75 v37.08,8.26
  Bottom 0.254: R39.2 29.76,2.83 32.3,5.37 R30.1 32.77,5.33 33.15,4.95 v33.15,4.57 | 27.18,2.29 27.47,2.45 28.23,2.45 28.45,2.67 29.72,2.67
TXD
  Top 0.254: SV1.3 34.92,17.27 35.69,16.51 37.97,16.51 39.37,15.11 39.37,12.83 38.83,12.29 IC1.31
U_BAT
  Top 0.254: C17.1 41.57,2.67 | 41.57,2.67 R15.2 | R14.1 34.42,1.78 35.31,2.67 39.24,2.67 | 39.24,2.67 41.57,2.67 | 39.24,2.67 39.24,3.81 37.72,5.33 37.72,6.73 37.21,7.24 35.56,7.24 35.24,6.92 IC1.22
VCC  (via drill 0.33 pad 0.41, 0.5 pad 0.41, 0.8 pad 0.36, 0.8 pad 0.41)  (5 unrouted)
  Top 0.254: R14.2 32.55,1.56 32.51,1.52 v30.48,1.52 | 17.87,18.58 C19.1 18.38,18.58 19.43,17.53 19.43,17.65 | 12.32,15.58 C18.1 12.79,15.88 13.39,15.88 T4.3 13.39,16.83 12.41,17.82 R3.1 | 11.97,13.46 NB+.3 13.47,13.18 R5.1 | 18.76,12.99 18.8,12.95 | R34.1 19.56,17.53 19.56,15.75 | C15.1 18.76,15.58 18.92,15.75 19.56,15.75 | 19.56,15.75 20.38,15.75 T2.3 | NC+.3 6.32,13.18 6.35,13.21 | NA+.3 20.59,13.18 R2.1 | 12.45,15.24 12.32,15.37
  Top 0.508: 12.32,15.37 12.32,13.46 | 19.05,15.49 19.05,13.46
  Route2 0.254: v30.48,1.52 29.46,2.54 27.3,2.54 25.53,4.32 25.53,10.03 25.27,10.29 25.27,11.05 25.53,11.3 25.53,11.94 21.97,15.49 4.7,15.49 v3.56,14.35
  Bottom 0.254: 10.64,17.04 10.67,17.02
  Bottom 0.406: 10.64,17.04 IC2.3 7.9,17.04 7.39,16.54 5.26,16.54 C13.1 4.47,15.26 v3.56,14.35
  Bottom 1.016: 1.14,17.14 1.27,17.14 C9.+
  Bottom 1.194: v1.14,14.73 v1.14,15.75 1.14,17.14
  other vias: 0.89,7.24
  pour Top (no thermals): 0,0 3.94,-0.13 3.94,15.24 2.29,15.24 2.29,18.03 0,18.03
  pour Top (no thermals): 3.81,14.48 5.33,14.48 5.33,12.06 10.54,12.06 10.54,13.72 12.45,13.72 12.45,12.06 17.53,12.06 17.53,13.72 19.56,13.72 19.56,12.06 24.13,12.06 24.13,9.53 3.81,9.53
  pour Top: 2.29,16.38 7.37,16.38 7.37,14.61 2.29,14.61
  pour Bottom: 0,7.75 2.16,7.75 2.16,2.92 0,2.92

### Text on the board
tDocu: 1 | 3 | 5 | 7 | 9
bDocu: 2 | 4 | 6 | 8
tSilk: - | 1 | C | D | + | C | B | A | MikroKopter.de
bSilk: - | 5V | + | - | BL-Ctrl 2.0c | PPM | ADR | 1-2-3 | C | (c) 2010 H.Buss | D | ADR5-8 | gnd | 4-5 | + | - | MikroKopter.de